# Altium schematic sheet Cover Page.SchDoc
size A; SheetNumber: 1; SheetTotal: 11
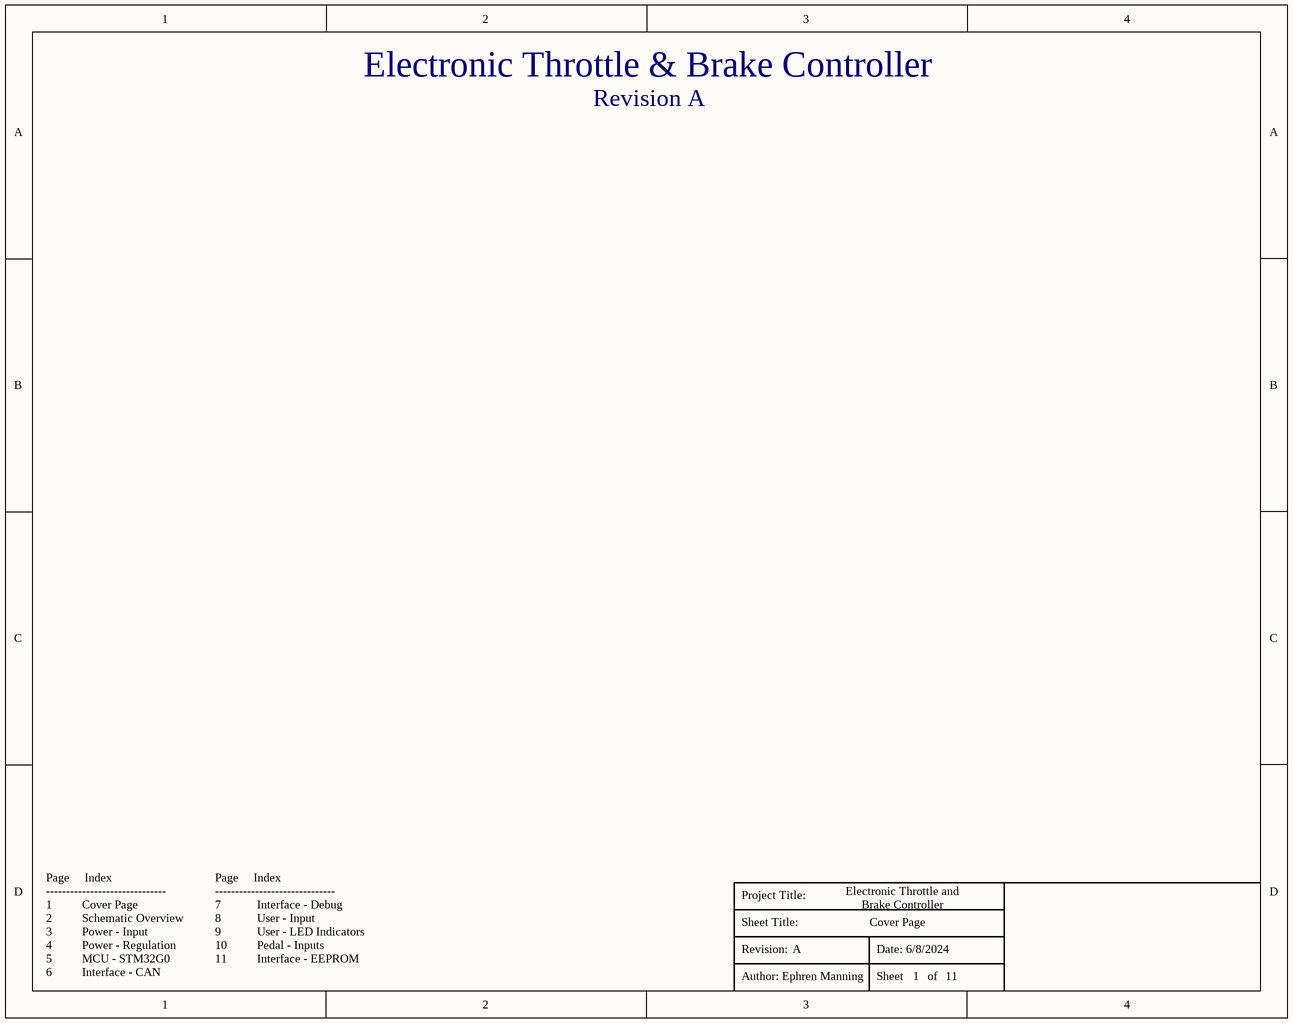
[diagram p0: Cover Page.SchDoc]

## Notes on the sheet
- Electronic Throttle & Brake Controller
- Revision A
- Electronic Throttle and
  Brake Controller
- A
- Cover Page
- 6/8/2024
- Page     Index
  ------------------------------
  1          Cover Page
  2          Schematic Overview
  3          Power - Input
  4          Power - Regulation
  5          MCU - STM32G0
  6          Interface - CAN
- Page     Index
  ------------------------------
  7            Interface - Debug
  8            User - Input
  9            User - LED Indicators
  10          Pedal - Inputs
  11          Interface - EEPROM
- Ephren Manning
- 1
- 11
- Project Title:
- Sheet Title:
- Revision:
- Date:
- Author:
- Sheet        of